# EasyEDA schematic 1-Schematic_PCB.json
TITLE: Circuit Board; REV: 1.0; Date: 2021-10-29; Sheet: 1/1; Drawn By: Himanshu; Company: Your Company
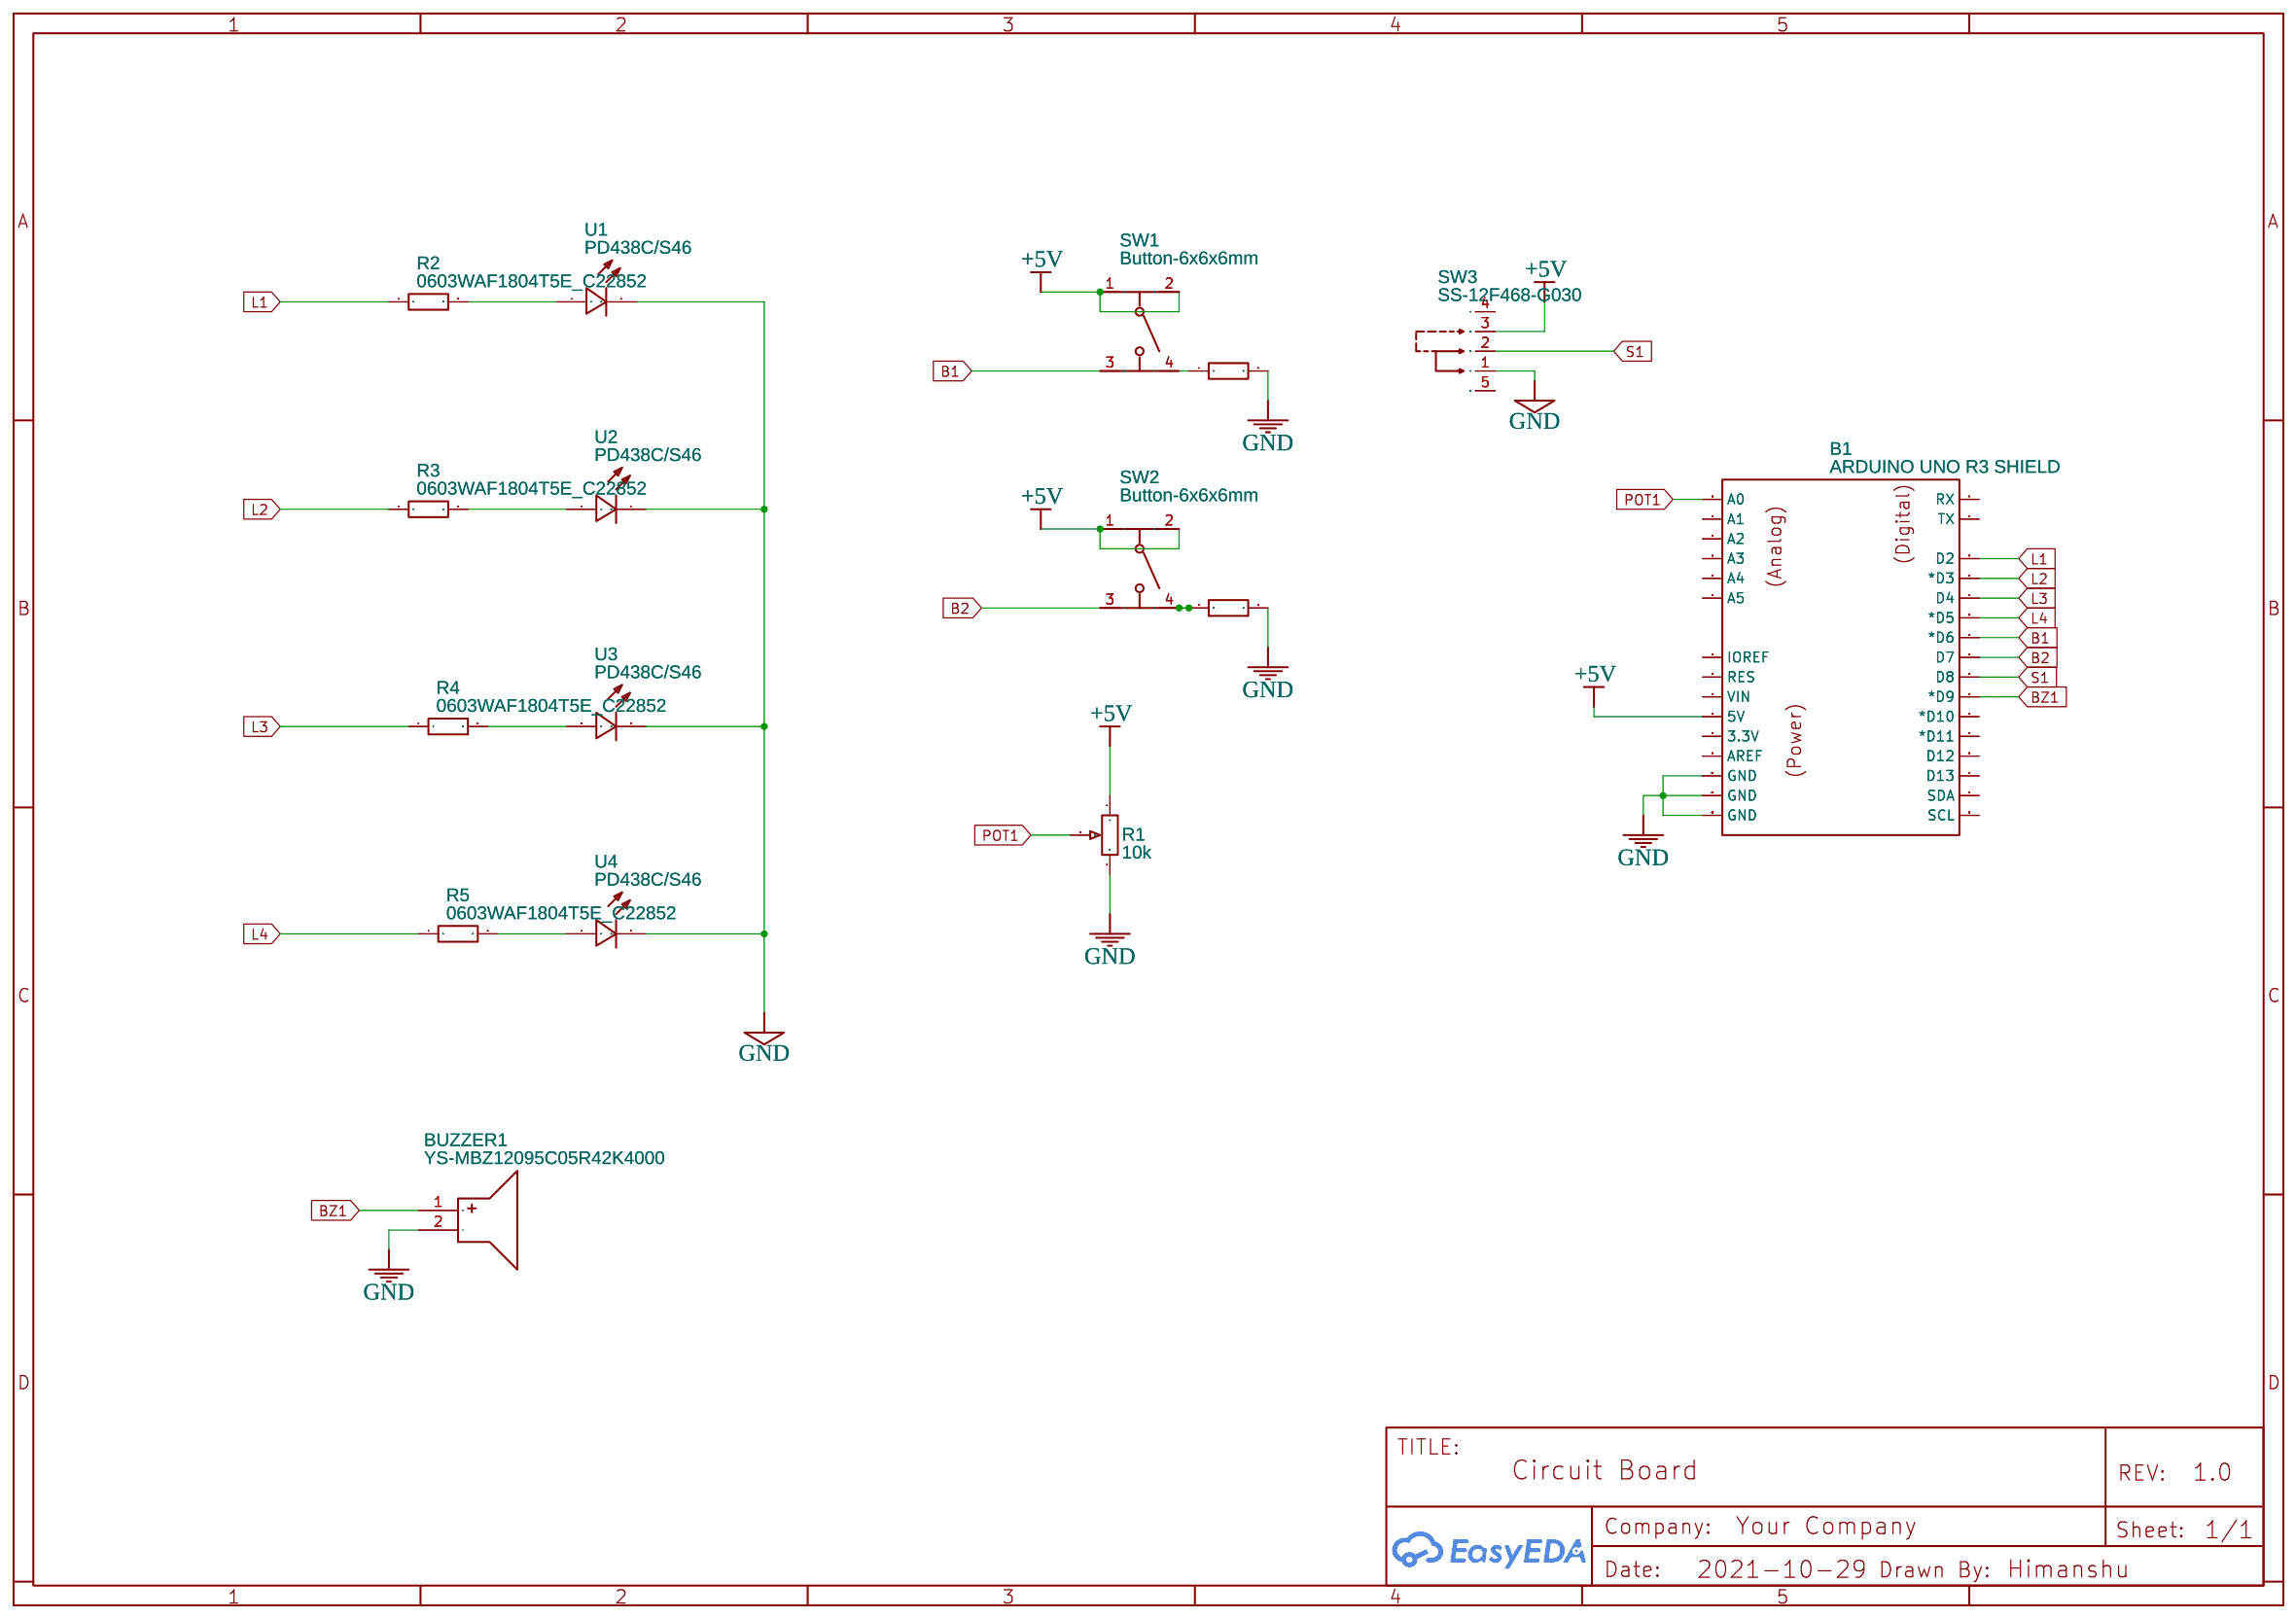
[diagram p0: schematic sheet]

## Parts
B1  ARDUINO UNO R3 SHIELD  [PKG-ARDUINO-UNO-R3-SHIELD]
BUZZER1  YS-MBZ12095C05R42K4000  [BUZ-TH_BD12.0-P6.50-D0.6-FD]
R1  10k  [AS488DS3-SDF5]
R2  0603WAF1804T5E_C22852  [R0603]
R3  0603WAF1804T5E_C22852  [R0603]
R4  0603WAF1804T5E_C22852  [R0603]
R5  0603WAF1804T5E_C22852  [R0603]
R6  0603WAF1804T5E_C22852  [R0603]
R7  0603WAF1804T5E_C22852  [R0603]
SW1  Button-6x6x6mm  [SW-TH_4P-L6.0-W6.0-P4.50-LS6.1]
SW2  Button-6x6x6mm  [SW-TH_4P-L6.0-W6.0-P4.50-LS6.1]
SW3  SS-12F468-G030  [SW-TH_G-SWITCH_SS-12F468-G030]
U1  PD438C/S46  [LED-TH_BD4.8-P2.54-FD]
U2  PD438C/S46  [LED-TH_BD4.8-P2.54-FD]
U3  PD438C/S46  [LED-TH_BD4.8-P2.54-FD]
U4  PD438C/S46  [LED-TH_BD4.8-P2.54-FD]

## Library data of the parts
B1 = ARDUINO UNO R3 SHIELD: Manufacturer: ?; Manufacturer Part: ?; Link: ?; Contributor: 電子工程系周柏宇
BUZZER1 = YS-MBZ12095C05R42K4000: Supplier: LCSC; Supplier Part: C2891357; Manufacturer: Fengming(锋鸣电子); Contributor: LCSC
R1 = 3362F-1-103LF: Supplier: Digi-Key; Manufacturer: Panasonic Electronic Components; Supplier Part: 3362F-1-103LF-ND
R2-R7 = 0603WAF1804T5E_C22852: Supplier Part: C22852; Supplier: LCSC; Manufacturer: UniOhm; Manufacturer Part: 0603WAF1804T5E; JLCPCB Part Class: Extended Part
SW1 SW2 = Button-6x6x6mm: Supplier Part: C71836; Supplier: LCSC; Manufacturer: BBJ; Manufacturer Part: Switch,6*6*6Plastic head,260G, 0.25mm,Straight line
SW3 = SS-12F468-G030: Supplier: LCSC; Supplier Part: C2848904; Manufacturer: G-Switch(品赞); Contributor: LCSC
U1-U4 = PD438C/S46: Supplier: LCSC; Manufacturer: EVERLIGHT; Contributor: LCSC; Supplier Part: C146238; JLCPCB Part Class: Extended Part

## Nets
+5V: B1.5V R1.1 SW1.1 SW1.2 SW2.1 SW2.2 SW3.3
GND: B1.GND@0(GND) B1.GND@1(GND) B1.GND@2(GND) BUZZER1.2(-) R1.3 R6.2 R7.2 SW3.1 U1.2(C) U2.2(C) U3.2(C) U4.2(C)
B1: B1.D6(*D6) SW1.3
B2: B1.D7 SW2.3
BZ1: B1.D9(*D9) BUZZER1.1(+)
L1: B1.D2 R2.1
L2: B1.D3(*D3) R3.1
L3: B1.D4 R4.1
L4: B1.D5(*D5) R5.1
POT1: B1.A0 R1.2
S1: B1.D8 SW3.2
Net-(R2-2): R2.2 U1.1(A)
Net-(R3-2): R3.2 U2.1(A)
Net-(R4-2): R4.2 U3.1(A)
Net-(R5-2): R5.2 U4.1(A)
Net-(R6-1): R6.1 SW1.4
Net-(R7-1): R7.1 SW2.4

Not connected (* = marked no-connect by the designer): B1 3.3V A1 A2 A3 A4 A5 AREF D10(*D10) D11(*D11) D12 D13 IOREF RES RX SCL SDA TX VIN; SW3 4 5
